# Altium schematic sheet USB2CAN_cx.SchDoc
size A4; SheetNumber: 1; SheetTotal: 1
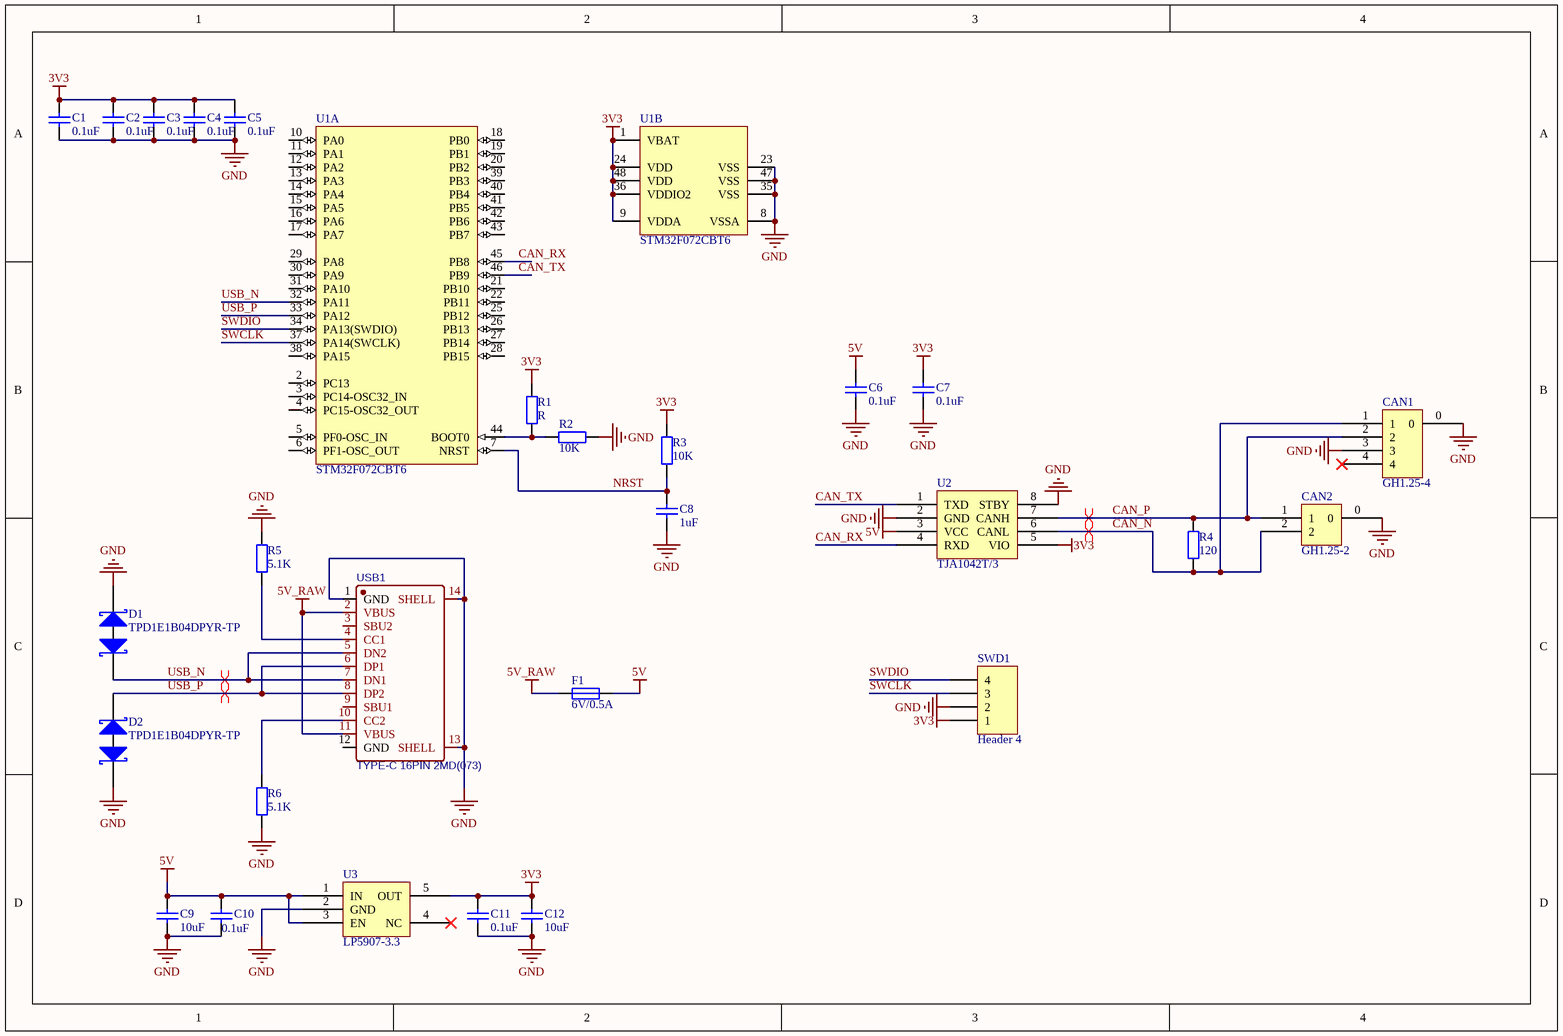
[diagram p0: USB2CAN_cx.SchDoc]

## Parts
C1  0.1uF  [0603_C]
C2  0.1uF  [0603_C]
C3  0.1uF  [0603_C]
C4  0.1uF  [0603_C]
C5  0.1uF  [0603_C]
C6  0.1uF  [0603_C]
C7  0.1uF  [0603_C]
C8  1uF  [0603_C]
C9  10uF  [0603_C]
C10  0.1uF  [0603_C]
C11  0.1uF  [0603_C]
C12  10uF  [0603_C]
CAN1  GH1.25-4  [SM04B-GHS_X1251WRS-04HF-LPSW]
CAN2  GH1.25-2  [SM02B-GHS_X1251WRS-02HF-LPSW]
D1  TPD1E1B04DPYR-TP  [0402_R]
D2  TPD1E1B04DPYR-TP  [0402_R]
F1  6V/0.5A  [0603_R]
R1  R  [0603_R]
R2  10K  [0603_R]
R3  10K  [0603_R]
R4  120  [0603_R]
R5  5.1K  [0603_R]
R6  5.1K  [0603_R]
SWD1  Header 4  [HDR1X4]
U1  STM32F072CBT6  [LQFP-48_7x7x05P]  (parts A,B of 2)
U2  TJA1042T/3  [SOP8]
U3  LP5907-3.3  [TSOT23-5]
USB1  TYPE-C 16PIN 2MD(073)  [USB-C-SMD_TYPE-C-6PIN-2MD-073]

## Nets
3V3: C1.2 C2.2 C3.2 C4.2 C5.2 C7.1 C11.2 C12.2 R1.2 R3.2 SWD1.1 U1.1(VBAT) U1.9(VDDA) U1.24(VDD) U1.36(VDDIO2) U1.48(VDD) U2.5(VIO) U3.5(OUT)
5V: C6.2 C9.2 C10.2 F1.2 U2.3(VCC) U3.1(IN) U3.3(EN)
5V_RAW: F1.1 USB1.2(VBUS) USB1.11(VBUS)
GND: C1.1 C2.1 C3.1 C4.1 C5.1 C6.1 C7.2 C8.1 C9.1 C10.1 C11.1 C12.1 CAN1.0 CAN1.3 CAN2.0 D1.2(K) D2.1(A) R2.2 R5.2 R6.1 SWD1.2 U1.8(VSSA) U1.23(VSS) U1.35(VSS) U1.47(VSS) U2.2(GND) U2.8(STBY) U3.2(GND) USB1.1(GND) USB1.13(SHELL) USB1.14(SHELL)
CAN_N: CAN1.1 CAN2.2 R4.1 U2.6(CANL)
CAN_P: CAN1.2 CAN2.1 R4.2 U2.7(CANH)
CAN_RX: U1.45(PB8) U2.4(RXD)
CAN_TX: U1.46(PB9) U2.1(TXD)
NRST: C8.2 R3.1 U1.7(NRST)
SWCLK: SWD1.3 U1.37(PA14(SWCLK))
SWDIO: SWD1.4 U1.34(PA13(SWDIO))
USB_N: D1.1(A) U1.32(PA11) USB1.5(DN2) USB1.7(DN1)
USB_P: D2.2(K) U1.33(PA12) USB1.6(DP1) USB1.8(DP2)
NetR1_1: R1.1 R2.1 U1.44(BOOT0)
NetR5_1: R5.1 USB1.4(CC1)
NetR6_2: R6.2 USB1.10(CC2)

Not connected (* = marked no-connect by the designer): CAN1 4*; U1 2(PC13) 3(PC14-OSC32_IN) 4(PC15-OSC32_OUT) 5(PF0-OSC_IN) 6(PF1-OSC_OUT) 10(PA0) 11(PA1) 12(PA2) 13(PA3) 14(PA4) 15(PA5) 16(PA6) 17(PA7) 18(PB0) 19(PB1) 20(PB2) 21(PB10) 22(PB11) 25(PB12) 26(PB13) 27(PB14) 28(PB15) 29(PA8) 30(PA9) 31(PA10) 38(PA15) 39(PB3) 40(PB4) 41(PB5) 42(PB6) 43(PB7); U3 4(NC)*; USB1 3(SBU2) 9(SBU1) 12(GND)

## Layout directives
differential pair: CAN_N, CAN_P, USB_N, USB_P

## Library data of the parts
C1-C12 = CAP: Capacitor; Published: 8-Jun-2000; LatestRevisionDate: 17-Jul-2002; LatestRevisionNote: Re-released for DXP Platform.; PackageReference: RAD-0.3; Publisher: Altium Limited; PackageDescription: Radial Cap, Thru-Hole; 2 Leads; 0.3 in Pin Spacing
D1 D2 = ESD_Diode: ESD Protection Diode; Published: 8-Jun-2000; LatestRevisionDate: 17-Jul-2002; LatestRevisionNote: Re-released for DXP Platform.; PackageReference: SMB; Publisher: Altium Limited; PackageDescription: DO-214-AA/SMB; 2 C-Bend Leads; Body 5.3 x 3.6 mm, inc. leads (LxW); Code_JEDEC: DO-214-AA
F1 = FUSE: Published: 8-Jun-2000; LatestRevisionDate: 17-Jul-2002; LatestRevisionNote: Re-released for DXP Platform.; PackageReference: AXIAL-0.4; Publisher: Altium Limited; PackageDescription: Axial Device, Thru-Hole; 2 Leads; 0.4 in Pin Spacing
R1-R6 = RES: Resistor; Published: 8-Jun-2000; LatestRevisionDate: 17-Jul-2002; LatestRevisionNote: Re-released for DXP Platform.; PackageReference: AXIAL-0.4; Publisher: Altium Limited; PackageDescription: Axial Device, Thru-Hole; 2 Leads; 0.4 in Pin Spacing
SWD1 = Header 4: Header, 4-Pin; LatestRevisionDate: 17-Jul-2002; LatestRevisionNote: Re-released for DXP Platform.; Publisher: Altium Limited
U1 = STM32F072C8T6: ARM Cortex-M0 32-bit MCU, 128 KB Flash, 4 KB Internal RAM, 39 I/Os, 48-pin LQFP, -40 to 85 degC, Tray; PartNumber: STM32F050C6T6; FLASH Size (Prog) (kB): 32; I/Os (High Current): 39; Internal RAM Size (kB): 4; Operating Frequency(F) (Processor speed) (MHz): 48; Supply Voltage(Vcc) min (V): 2; DatasheetVersion: Rev. 1; PackageVersion: Rev. 6, 06/2013; PackageReference: LQFP48; PackageDescription: 48-Pin Low Profile Quad Flat Package, 7 x 7 mm Body, 0.5 mm Pitch; Core: ARM Cortex-M0; Packing: Tray; Mounting Technology: Surface Mount
U3 = LP5907
USB1 = TYPE-C 16PIN 2MD(073): BOM_Manufacturer: SHOU HAN(首韩); Contributor: LCSC; BOM_Supplier: LCSC; BOM_Supplier Part: C2765186; BOM_Manufacturer Part: TYPE-C 16PIN 2MD(073); spicePre: U; spiceSymbolName: TYPE-C 16PIN 2MD(073)